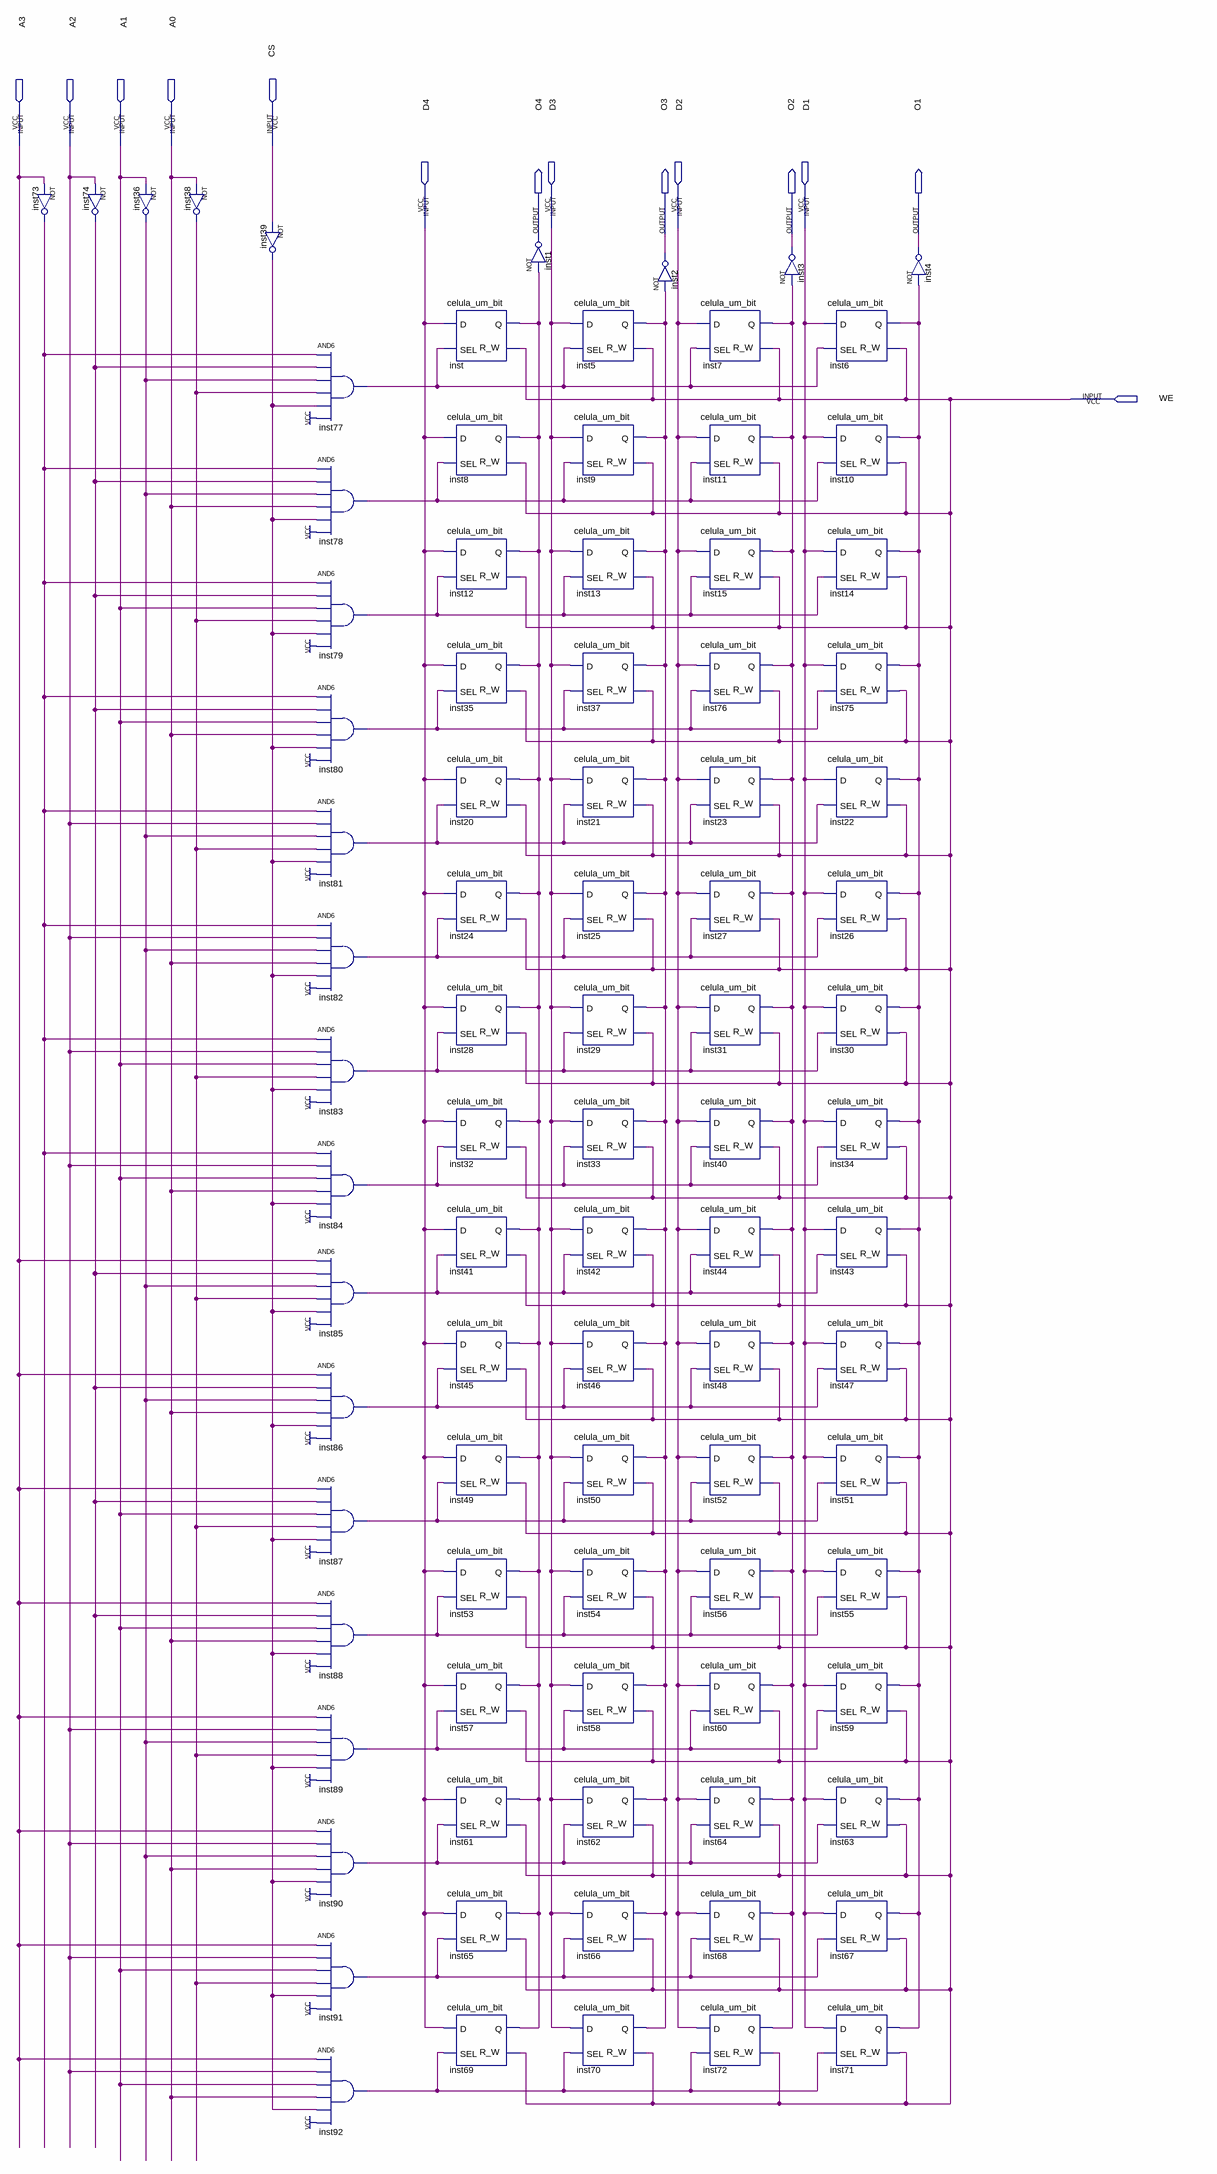
[diagram p0: schematic sheet]
// Quartus schematic ci_74ls189.bdf as structural Verilog: 89 symbols, 14 pins
module ci_74ls189 (
  input  A3,
  input  A2,
  input  A1,
  input  A0,
  input  CS,
  input  D4,
  input  D3,
  input  D2,
  input  D1,
  input  WE,
  output O4,
  output O3,
  output O2,
  output O1
);

  wire inst5_q, inst6_q, inst7_q, inst36_out, inst38_out, inst39_out, inst73_out, inst74_out, inst77_out,
       inst78_out, inst79_out, inst80_out, inst81_out, inst82_out, inst83_out, inst84_out, inst85_out,
       inst86_out, inst87_out, inst88_out, inst89_out, inst90_out, inst91_out, inst92_out, inst_q;

  not inst73 (inst73_out, A3);
  not inst74 (inst74_out, A2);
  not inst36 (inst36_out, A1);
  not inst38 (inst38_out, A0);
  not inst39 (inst39_out, CS);
  and inst77 (inst77_out, inst73_out, inst74_out, inst36_out, inst38_out, inst39_out, 1'b1);
  and inst78 (inst78_out, inst73_out, inst74_out, inst36_out, A0, inst39_out, 1'b1);
  and inst79 (inst79_out, inst73_out, inst74_out, A1, inst38_out, inst39_out, 1'b1);
  and inst80 (inst80_out, inst73_out, inst74_out, A1, A0, inst39_out, 1'b1);
  and inst81 (inst81_out, inst73_out, A2, inst36_out, inst38_out, inst39_out, 1'b1);
  and inst82 (inst82_out, inst73_out, A2, inst36_out, A0, inst39_out, 1'b1);
  and inst83 (inst83_out, inst73_out, A2, A1, inst38_out, inst39_out, 1'b1);
  and inst84 (inst84_out, inst73_out, A2, A1, A0, inst39_out, 1'b1);
  and inst85 (inst85_out, A3, inst74_out, inst36_out, inst38_out, inst39_out, 1'b1);
  and inst86 (inst86_out, A3, inst74_out, inst36_out, A0, inst39_out, 1'b1);
  and inst87 (inst87_out, A3, inst74_out, A1, inst38_out, inst39_out, 1'b1);
  and inst88 (inst88_out, A3, inst74_out, A1, A0, inst39_out, 1'b1);
  and inst89 (inst89_out, A3, A2, inst36_out, inst38_out, inst39_out, 1'b1);
  and inst90 (inst90_out, A3, A2, inst36_out, A0, inst39_out, 1'b1);
  and inst91 (inst91_out, A3, A2, A1, inst38_out, inst39_out, 1'b1);
  and inst92 (inst92_out, A3, A2, A1, A0, inst39_out, 1'b1);
  celula_um_bit inst (.D(D4), .R_W(WE), .SEL(inst77_out), .Q(inst_q));
  celula_um_bit inst8 (.D(D4), .R_W(WE), .SEL(inst78_out), .Q(inst_q));
  celula_um_bit inst12 (.D(D4), .R_W(WE), .SEL(inst79_out), .Q(inst_q));
  celula_um_bit inst35 (.D(D4), .R_W(WE), .SEL(inst80_out), .Q(inst_q));
  celula_um_bit inst20 (.D(D4), .R_W(WE), .SEL(inst81_out), .Q(inst_q));
  celula_um_bit inst24 (.D(D4), .R_W(WE), .SEL(inst82_out), .Q(inst_q));
  celula_um_bit inst28 (.D(D4), .R_W(WE), .SEL(inst83_out), .Q(inst_q));
  celula_um_bit inst32 (.D(D4), .R_W(WE), .SEL(inst84_out), .Q(inst_q));
  celula_um_bit inst41 (.D(D4), .R_W(WE), .SEL(inst85_out), .Q(inst_q));
  celula_um_bit inst45 (.D(D4), .R_W(WE), .SEL(inst86_out), .Q(inst_q));
  celula_um_bit inst49 (.D(D4), .R_W(WE), .SEL(inst87_out), .Q(inst_q));
  celula_um_bit inst53 (.D(D4), .R_W(WE), .SEL(inst88_out), .Q(inst_q));
  celula_um_bit inst57 (.D(D4), .R_W(WE), .SEL(inst89_out), .Q(inst_q));
  celula_um_bit inst61 (.D(D4), .R_W(WE), .SEL(inst90_out), .Q(inst_q));
  celula_um_bit inst65 (.D(D4), .R_W(WE), .SEL(inst91_out), .Q(inst_q));
  celula_um_bit inst69 (.D(D4), .R_W(WE), .SEL(inst92_out), .Q(inst_q));
  not inst1 (O4, inst_q);
  celula_um_bit inst5 (.D(D3), .R_W(WE), .SEL(inst77_out), .Q(inst5_q));
  celula_um_bit inst9 (.D(D3), .R_W(WE), .SEL(inst78_out), .Q(inst5_q));
  celula_um_bit inst13 (.D(D3), .R_W(WE), .SEL(inst79_out), .Q(inst5_q));
  celula_um_bit inst37 (.D(D3), .R_W(WE), .SEL(inst80_out), .Q(inst5_q));
  celula_um_bit inst21 (.D(D3), .R_W(WE), .SEL(inst81_out), .Q(inst5_q));
  celula_um_bit inst25 (.D(D3), .R_W(WE), .SEL(inst82_out), .Q(inst5_q));
  celula_um_bit inst29 (.D(D3), .R_W(WE), .SEL(inst83_out), .Q(inst5_q));
  celula_um_bit inst33 (.D(D3), .R_W(WE), .SEL(inst84_out), .Q(inst5_q));
  celula_um_bit inst42 (.D(D3), .R_W(WE), .SEL(inst85_out), .Q(inst5_q));
  celula_um_bit inst46 (.D(D3), .R_W(WE), .SEL(inst86_out), .Q(inst5_q));
  celula_um_bit inst50 (.D(D3), .R_W(WE), .SEL(inst87_out), .Q(inst5_q));
  celula_um_bit inst54 (.D(D3), .R_W(WE), .SEL(inst88_out), .Q(inst5_q));
  celula_um_bit inst58 (.D(D3), .R_W(WE), .SEL(inst89_out), .Q(inst5_q));
  celula_um_bit inst62 (.D(D3), .R_W(WE), .SEL(inst90_out), .Q(inst5_q));
  celula_um_bit inst66 (.D(D3), .R_W(WE), .SEL(inst91_out), .Q(inst5_q));
  celula_um_bit inst70 (.D(D3), .R_W(WE), .SEL(inst92_out), .Q(inst5_q));
  not inst2 (O3, inst5_q);
  celula_um_bit inst7 (.D(D2), .R_W(WE), .SEL(inst77_out), .Q(inst7_q));
  celula_um_bit inst11 (.D(D2), .R_W(WE), .SEL(inst78_out), .Q(inst7_q));
  celula_um_bit inst15 (.D(D2), .R_W(WE), .SEL(inst79_out), .Q(inst7_q));
  celula_um_bit inst76 (.D(D2), .R_W(WE), .SEL(inst80_out), .Q(inst7_q));
  celula_um_bit inst23 (.D(D2), .R_W(WE), .SEL(inst81_out), .Q(inst7_q));
  celula_um_bit inst27 (.D(D2), .R_W(WE), .SEL(inst82_out), .Q(inst7_q));
  celula_um_bit inst31 (.D(D2), .R_W(WE), .SEL(inst83_out), .Q(inst7_q));
  celula_um_bit inst40 (.D(D2), .R_W(WE), .SEL(inst84_out), .Q(inst7_q));
  celula_um_bit inst44 (.D(D2), .R_W(WE), .SEL(inst85_out), .Q(inst7_q));
  celula_um_bit inst48 (.D(D2), .R_W(WE), .SEL(inst86_out), .Q(inst7_q));
  celula_um_bit inst52 (.D(D2), .R_W(WE), .SEL(inst87_out), .Q(inst7_q));
  celula_um_bit inst56 (.D(D2), .R_W(WE), .SEL(inst88_out), .Q(inst7_q));
  celula_um_bit inst60 (.D(D2), .R_W(WE), .SEL(inst89_out), .Q(inst7_q));
  celula_um_bit inst64 (.D(D2), .R_W(WE), .SEL(inst90_out), .Q(inst7_q));
  celula_um_bit inst68 (.D(D2), .R_W(WE), .SEL(inst91_out), .Q(inst7_q));
  celula_um_bit inst72 (.D(D2), .R_W(WE), .SEL(inst92_out), .Q(inst7_q));
  not inst3 (O2, inst7_q);
  celula_um_bit inst6 (.D(D1), .R_W(WE), .SEL(inst77_out), .Q(inst6_q));
  celula_um_bit inst10 (.D(D1), .R_W(WE), .SEL(inst78_out), .Q(inst6_q));
  celula_um_bit inst14 (.D(D1), .R_W(WE), .SEL(inst79_out), .Q(inst6_q));
  celula_um_bit inst75 (.D(D1), .R_W(WE), .SEL(inst80_out), .Q(inst6_q));
  celula_um_bit inst22 (.D(D1), .R_W(WE), .SEL(inst81_out), .Q(inst6_q));
  celula_um_bit inst26 (.D(D1), .R_W(WE), .SEL(inst82_out), .Q(inst6_q));
  celula_um_bit inst30 (.D(D1), .R_W(WE), .SEL(inst83_out), .Q(inst6_q));
  celula_um_bit inst34 (.D(D1), .R_W(WE), .SEL(inst84_out), .Q(inst6_q));
  celula_um_bit inst43 (.D(D1), .R_W(WE), .SEL(inst85_out), .Q(inst6_q));
  celula_um_bit inst47 (.D(D1), .R_W(WE), .SEL(inst86_out), .Q(inst6_q));
  celula_um_bit inst51 (.D(D1), .R_W(WE), .SEL(inst87_out), .Q(inst6_q));
  celula_um_bit inst55 (.D(D1), .R_W(WE), .SEL(inst88_out), .Q(inst6_q));
  celula_um_bit inst59 (.D(D1), .R_W(WE), .SEL(inst89_out), .Q(inst6_q));
  celula_um_bit inst63 (.D(D1), .R_W(WE), .SEL(inst90_out), .Q(inst6_q));
  celula_um_bit inst67 (.D(D1), .R_W(WE), .SEL(inst91_out), .Q(inst6_q));
  celula_um_bit inst71 (.D(D1), .R_W(WE), .SEL(inst92_out), .Q(inst6_q));
  not inst4 (O1, inst6_q);
endmodule
